# Altium project transformer.PrjPcb
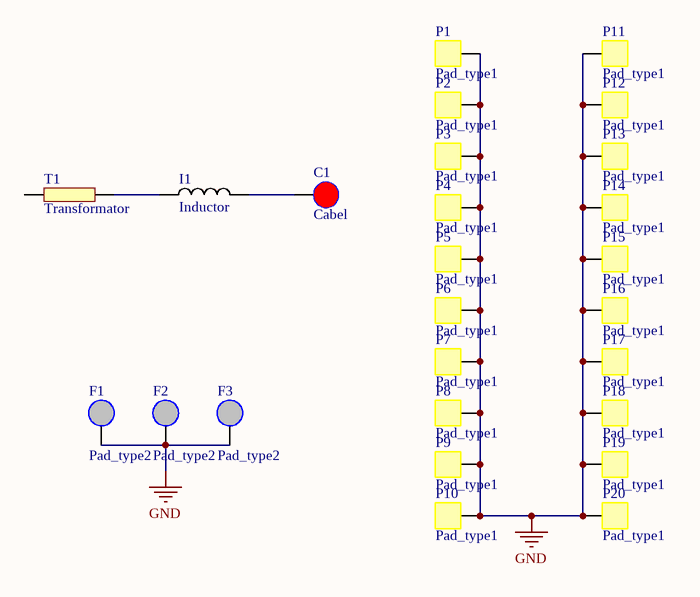
[diagram p0: transformer.SchDoc]
1 sheet, 26 parts. Net scope: global (net labels, ports and power ports of the same name join across sheets).
Board file: transformer.PcbDoc

## Sheet transformer.SchDoc
size A4; SheetNumber: 1; SheetTotal: 1

### Parts
C1  Cabel  [pad_type3]
F1  Pad_type2  [pad_type2]
F2  Pad_type2  [pad_type2]
F3  Pad_type2  [pad_type2]
I1  Inductor  [Inductor]
P1  Pad_type1  [pad_type1]
P2  Pad_type1  [pad_type1]
P3  Pad_type1  [pad_type1]
P4  Pad_type1  [pad_type1]
P5  Pad_type1  [pad_type1]
P6  Pad_type1  [pad_type1]
P7  Pad_type1  [pad_type1]
P8  Pad_type1  [pad_type1]
P9  Pad_type1  [pad_type1]
P10  Pad_type1  [pad_type1]
P11  Pad_type1  [pad_type1]
P12  Pad_type1  [pad_type1]
P13  Pad_type1  [pad_type1]
P14  Pad_type1  [pad_type1]
P15  Pad_type1  [pad_type1]
P16  Pad_type1  [pad_type1]
P17  Pad_type1  [pad_type1]
P18  Pad_type1  [pad_type1]
P19  Pad_type1  [pad_type1]
P20  Pad_type1  [pad_type1]
T1  Transformator  [tr_all]

### Nets
GND: F1.1 F2.1 F3.1 P1.1 P2.1 P3.1 P4.1 P5.1 P6.1 P7.1 P8.1 P9.1 P10.1 P11.1 P12.1 P13.1 P14.1 P15.1 P16.1 P17.1 P18.1 P19.1 P20.1
NetC1_1: C1.1 I1.2
NetI1_1: I1.1 T1.2

Not connected (* = marked no-connect by the designer): T1 1